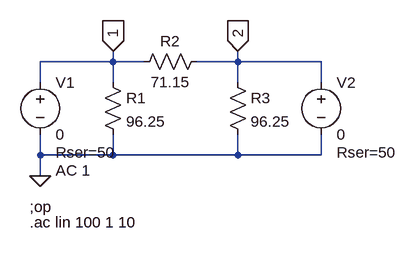
[diagram p0: schematic Pi_attenuator.asc]
Pi_attenuator.asc, the LTspice schematic file:
Version 4
SHEET 1 880 680
WIRE 96 80 96 64
WIRE 96 80 -16 80
WIRE 144 80 96 80
WIRE 288 80 288 64
WIRE 288 80 224 80
WIRE 416 80 288 80
WIRE -16 112 -16 80
WIRE 96 112 96 80
WIRE 288 112 288 80
WIRE 416 112 416 80
WIRE -16 224 -16 192
WIRE 96 224 96 192
WIRE 96 224 -16 224
WIRE 288 224 288 192
WIRE 288 224 96 224
WIRE 416 224 416 192
WIRE 416 224 288 224
WIRE -16 256 -16 224
FLAG -16 256 0
FLAG 96 64 1
IOPIN 96 64 In
FLAG 288 64 2
IOPIN 288 64 In
SYMBOL res 80 96 R0
SYMATTR InstName R1
SYMATTR Value 96.25
SYMBOL res 240 64 R90
WINDOW 0 0 56 VBottom 2
WINDOW 3 32 56 VTop 2
SYMATTR InstName R2
SYMATTR Value 71.15
SYMBOL res 272 96 R0
SYMATTR InstName R3
SYMATTR Value 96.25
SYMBOL voltage -16 96 R0
WINDOW 123 24 152 Left 2
WINDOW 39 24 124 Left 2
SYMATTR InstName V1
SYMATTR Value 0
SYMATTR Value2 AC 1
SYMATTR SpiceLine Rser=50
SYMBOL voltage 416 96 R0
WINDOW 123 0 0 Left 0
WINDOW 39 24 124 Left 2
SYMATTR InstName V2
SYMATTR Value 0
SYMATTR SpiceLine Rser=50
TEXT -32 304 Left 2 !;op
TEXT -32 328 Left 2 !.ac lin 100 1 10

The netlist it stands for:
* Pi_attenuator.asc
R1 1 0 96.25
R2 2 1 71.15
R3 2 0 96.25
V1 1 0 0 AC 1 Rser=50
V2 2 0 0 Rser=50
;op
.ac lin 100 1 10
.backanno
.end